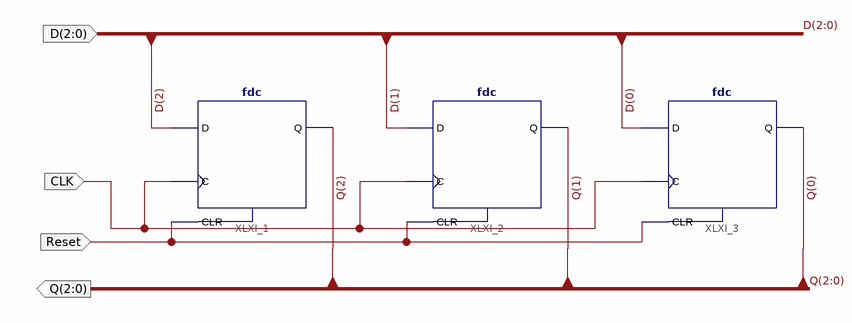
[diagram p0: schematic sheet 1]
// Xilinx ISE schematic PC.sch (spartan3e) as structural Verilog: 3 symbols, 4 ports
module PC (
  input  [2:0] D,
  input  Reset,
  input  CLK,
  output [2:0] Q
);

  fdc XLXI_1 (.C(CLK), .CLR(Reset), .D(D[2]), .Q(Q[2]));
  fdc XLXI_2 (.C(CLK), .CLR(Reset), .D(D[1]), .Q(Q[1]));
  fdc XLXI_3 (.C(CLK), .CLR(Reset), .D(D[0]), .Q(Q[0]));
endmodule
